# EAGLE design Sensormount (EAGLE 6.4)
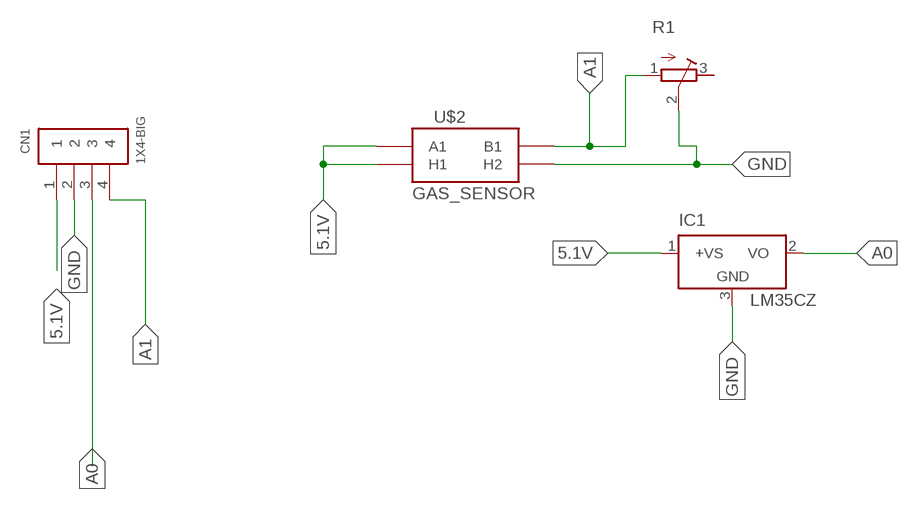
[diagram p0: schematic, sheet 1]

## Parts
CN1  1X4-BIG  [1X04-BIG]
IC1  LM35CZ  [TO92]
R1  R-TRIMM64W  [RTRIM64W]
U$2  GAS_SENSOR  [MQ-3]

## Nets
5.1V: CN1.1 IC1.1(+VS) U$2.A1 U$2.HA(H1)
A0: CN1.3 IC1.2(VO)
A1: CN1.4 R1.1(A) U$2.B1
GND: CN1.2 IC1.3(GND) R1.2(S) U$2.HB(H2)
Unconnected: R1.3(E)

## Library data of the parts
CN1 = adafruit:1X4: 4-pin connector
IC1 = lm35:LM35: Single-Supply Centigrade Temperature Sensor Vout = (10mV/°C x Temp °C) +5mmmV Source: http://www.national.com/ds/LM/LM35.pdf
R1 = rcl:R-TRIMM: Trimm resistor
U$2 = mq3:GAS_SENSOR: MQ-3 Gas Sensor. FP not tested. Part#

## Board
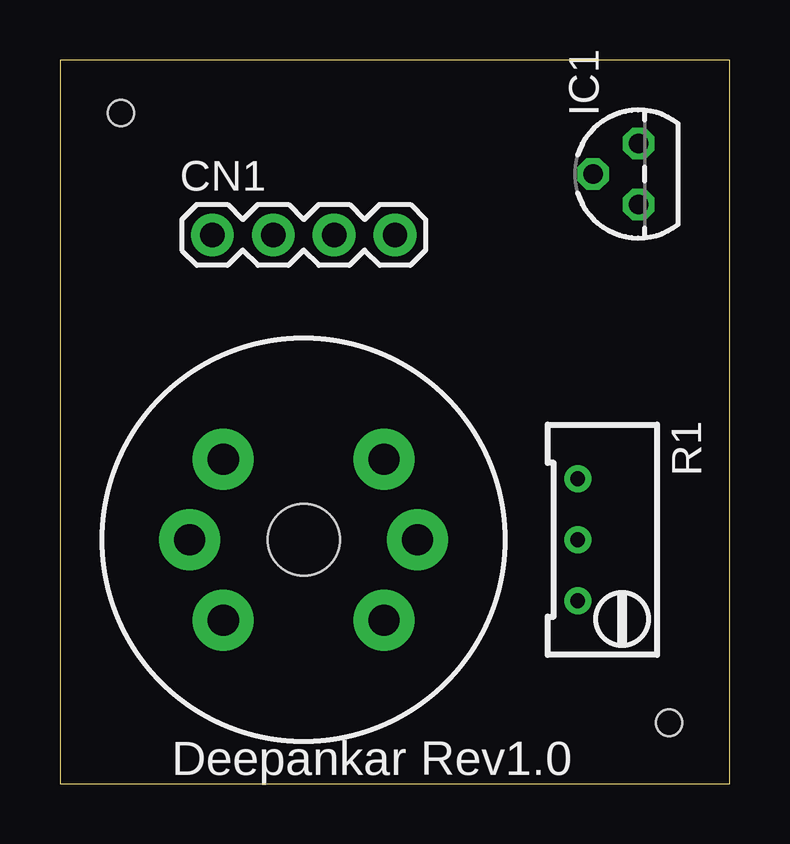
[diagram p1: board, top side]
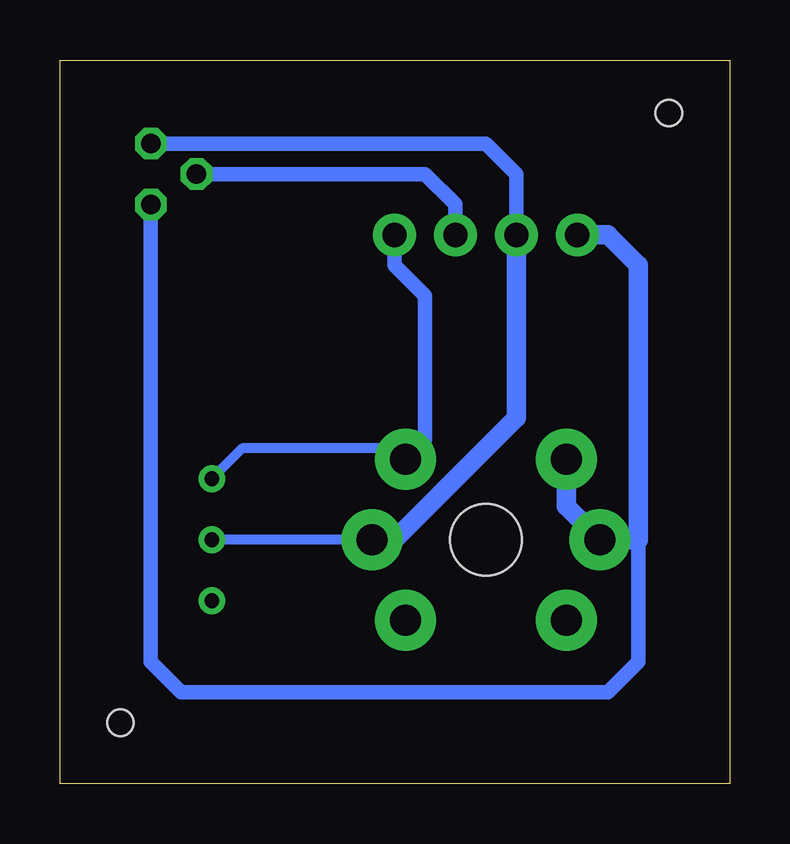
[diagram p2: board, bottom side, seen from below]

Size 27.92 x 30.15 mm. Coordinates in mm from the lower left corner, seen from the top.
Outline: 0,0 27.92,0 27.92,30.15 0,30.15 0,0
Copper layers (1*16): Top 0.035mm / dielectric 1.5mm / Bottom 0.035mm
Design rules "default": minimum track width 10mil, minimum drill 24mil, track to track 8mil, track to pad 8mil, pad to pad 8mil, via to via 8mil, smd to smd 8mil, copper to edge 40mil, drill to drill 8mil, minimum pad ring 10mil, minimum via ring 8mil, stop-mask expansion 4mil, vias tented up to drill 0mil, thermal gap 10mil
Holes 1.1 mm at 2.54,27.94 25.4,2.54

### Footprints (pad centres in the part's own frame; a part is rotated, then mirrored left to right if it is on the bottom)
1X04-BIG = drill 1.016 pad 1.778: 1 0,0; 2 2.54,0; 3 5.08,0; 4 7.62,0
TO92 = drill 0.813 octagon: 1 -1.27,0; 2 0,1.905; 3 1.27,0
RTRIM64W = drill 0.61: 1 1.27,-2.54; 2 1.27,0; 3 1.27,2.54
MQ-3 = drill 1.3 pad 2.54: A1 -3.35,3.35; A2 -3.35,-3.35; B1 3.35,3.35; B2 3.35,-3.35; HA -4.75,0; HB 4.75,0 | hole 3: 0,0

### Placement (x,y rotation side)
CN1  6.35,22.86 0 top
IC1  24.13,25.4 90 top
R1  22.86,10.16 180 top
U$2  10.16,10.16 0 top

### Tracks (layer width: path | path; a pad name or v marks a point on that pad's centre or on a via)
5.1V
  Bottom 0.406: 5.08,10.16 U$2.HA
  Bottom 0.61: 3.81,10.16 3.81,5.08 5.08,3.81 22.86,3.81 24.13,5.08 IC1.1
  Bottom 0.813: CN1.1 5.08,22.86 3.81,21.59 3.81,10.16 5.08,10.16 | U$2.A1 6.81,11.56 U$2.HA
A0
  Bottom 0.61: IC1.2 12.7,25.4 11.43,24.13 CN1.3
A1
  Bottom 0.406: U$2.B1 13.97,13.97 20.32,13.97 R1.1
  Bottom 0.61: U$2.B1 12.7,14.32 12.7,20.32 13.97,21.59 CN1.4
GND
  Bottom 0.406: U$2.HB R1.2
  Bottom 0.61: IC1.3 10.16,26.67 8.89,25.4 CN1.2
  Bottom 0.813: CN1.2 8.89,15.24 13.97,10.16 U$2.HB

### Text on the board
_tplace: Deepankar Rev1.0